# Altium schematic sheet my-cnc.SchDoc
size B
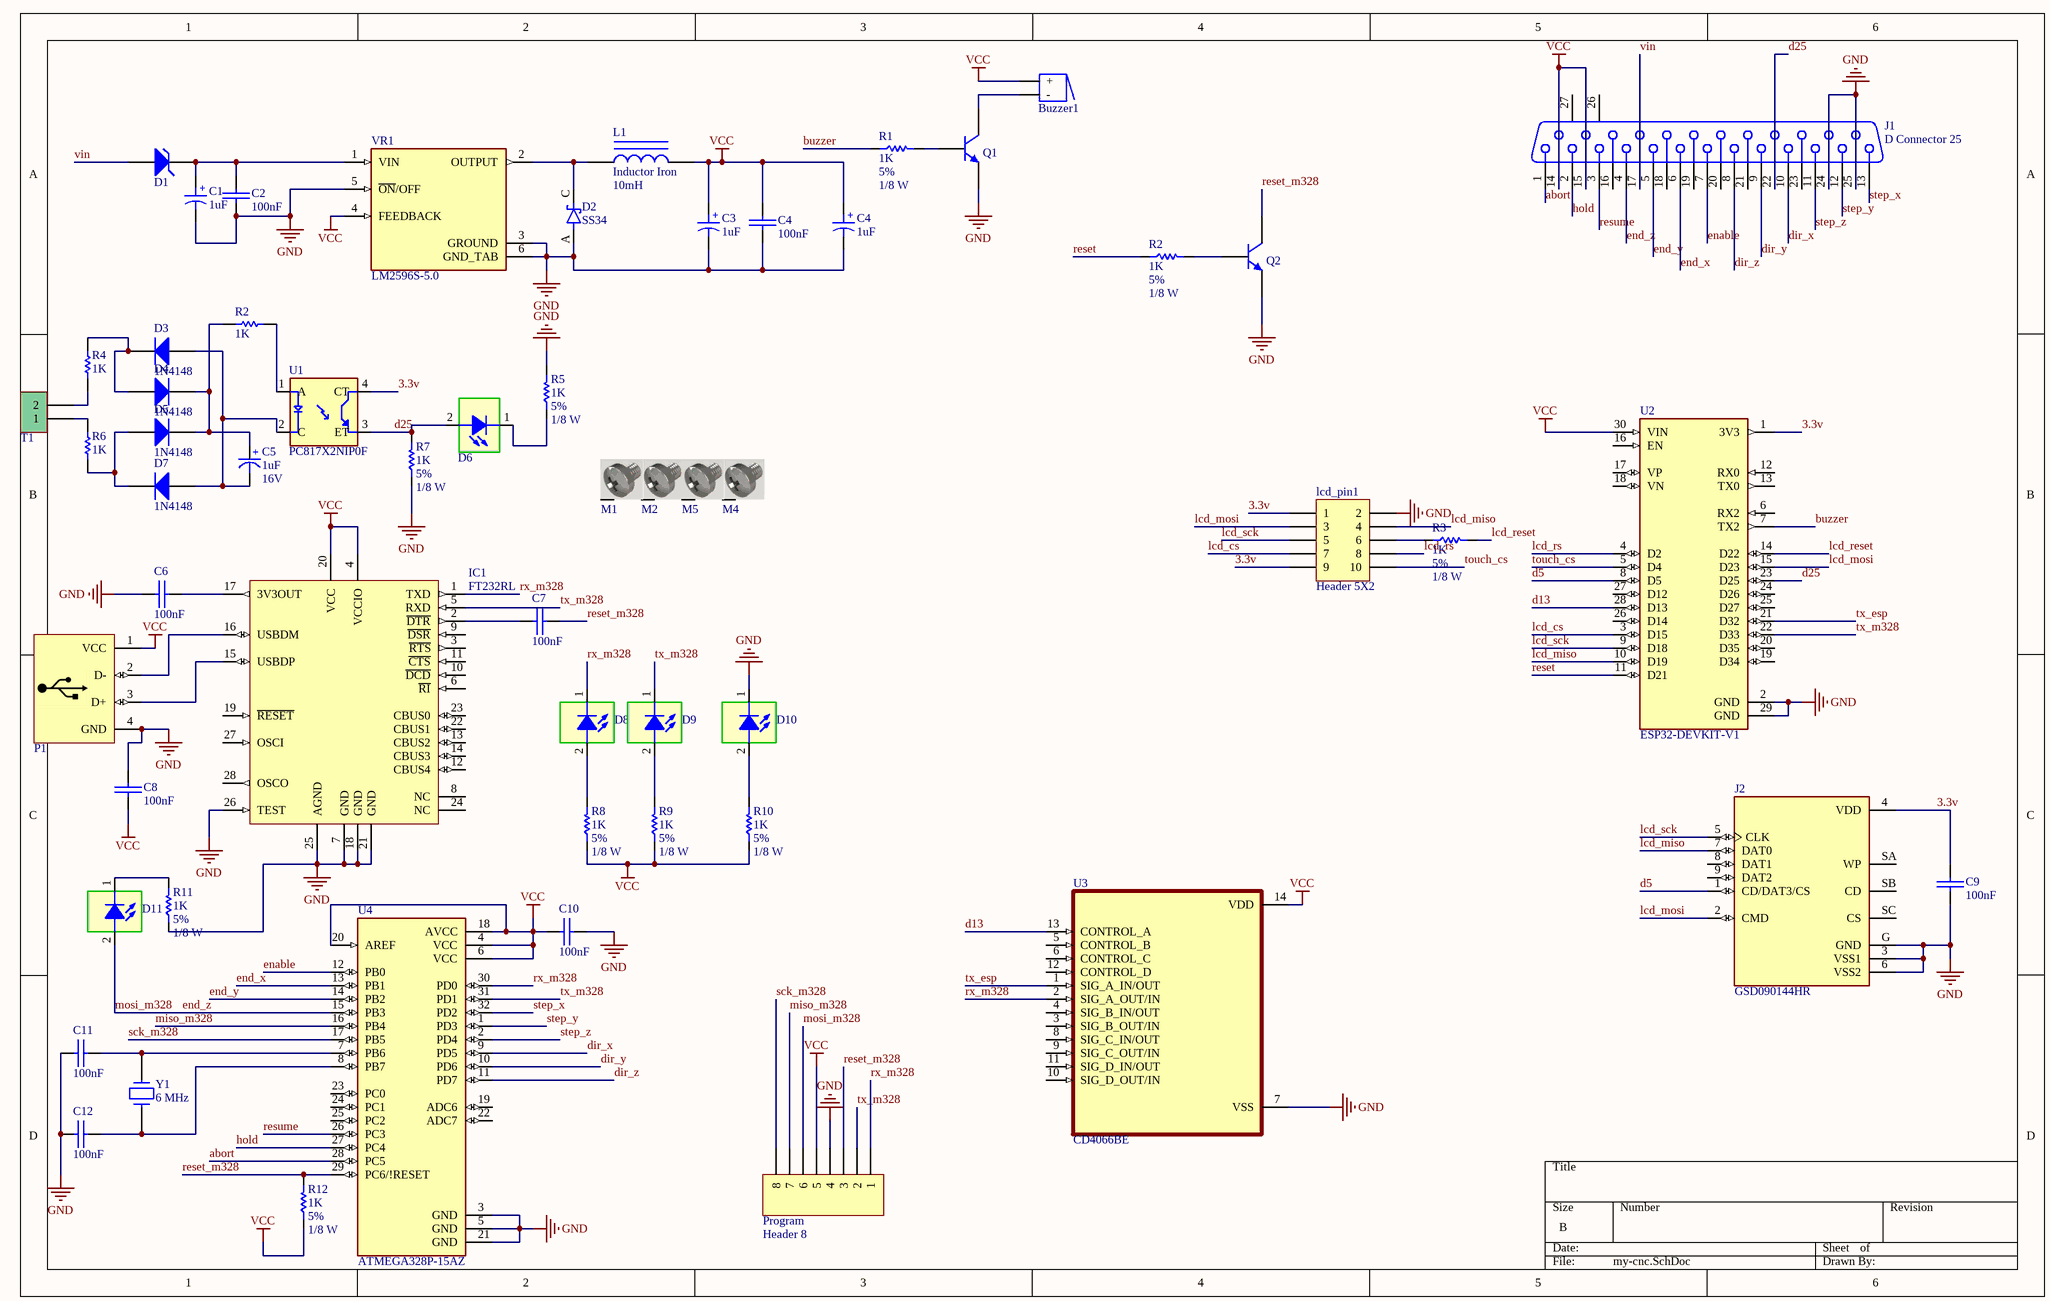
[diagram p0: my-cnc.SchDoc]

## Parts
(Parts that share a designator on the sheet are numbered #1, #2 ... from top to bottom, then left to right.)
Buzzer1  Buzzer  [BUZZER]  (value not drawn)
C1  1uF  [CAP SMD 470uF]
C2  100nF  [SMD_CAP_1206]
C3  1uF  [CAP SMD 470uF]
C4#1  1uF  [CAP SMD 470uF]
C4#2  100nF  [SMD_CAP_1206]
C5  Voltage: 16V  [cap 03]  (hidden comment: 1uF)
C6  100nF  [SMD_CAP_1206]
C7  100nF  [SMD_CAP_1206]
C8  100nF  [SMD_CAP_1206]
C9  100nF  [SMD_CAP_1206]
C10  100nF  [SMD_CAP_1206]
C11  100nF  [SMD_CAP_1206]
C12  100nF  [SMD_CAP_1206]
D1  Diode Zener  [Diode 1W]  (value not drawn)
D2  SS34  [DIOM7959X265N]
D3  1N4148  [DO-35]
D4  1N4148  [DO-35]
D5  1N4148  [DO-35]
D6  SMD 1206 LED  [LED 1206]  (value not drawn)
D7  1N4148  [DO-35]
D8  SMD 1206 LED  [LED 1206]  (value not drawn)
D9  SMD 1206 LED  [LED 1206]  (value not drawn)
D10  SMD 1206 LED  [LED 1206]  (value not drawn)
D11  SMD 1206 LED  [LED 1206]  (value not drawn)
IC1  FT232RL  [SSOP-28_L]
J1  D Connector 25  [DSUB1.385-2H25A]
J2  GSD090144HR  [AMPHENOL_GSD090144HR]
L1  Inductor Iron  value 10mH  [AXIAL-0.9]
lcd_pin1  Header 5X2  [HDR2X5]
M1  Screw  [Board Screw]  (value not drawn)
M2  Screw  [Board Screw]  (value not drawn)
M4  Screw  [Board Screw]  (value not drawn)
M5  Screw  [Board Screw]  (value not drawn)
P1  USB Connector  [USB2.5-2H4F]  (value not drawn)
Program  Header 8  [HDR1X8]
Q1  BC547  [TO-92 BENT]  (value not drawn)
Q2  BC547  [TO-92 BENT]  (value not drawn)
R1  Tolerance: 5%  Power: 1/8 W  [RES 1206 (3216X08L)]  (hidden comment: 1K)
R2#1  Tolerance: 5%  Power: 1/8 W  [RES 1206 (3216X08L)]  (hidden comment: 1K)
R2#2  1K  [Axial 0_25w_2_54mm]
R3  Tolerance: 5%  Power: 1/8 W  [RES 1206 (3216X08L)]  (hidden comment: 1K)
R4  1K  [Axial 0_25w_2_54mm]
R5  Tolerance: 5%  Power: 1/8 W  [RES 1206 (3216X08L)]  (hidden comment: 1K)
R6  1K  [Axial 0_25w_2_54mm]
R7  Tolerance: 5%  Power: 1/8 W  [RES 1206 (3216X08L)]  (hidden comment: 1K)
R8  Tolerance: 5%  Power: 1/8 W  [RES 1206 (3216X08L)]  (hidden comment: 1K)
R9  Tolerance: 5%  Power: 1/8 W  [RES 1206 (3216X08L)]  (hidden comment: 1K)
R10  Tolerance: 5%  Power: 1/8 W  [RES 1206 (3216X08L)]  (hidden comment: 1K)
R11  Tolerance: 5%  Power: 1/8 W  [RES 1206 (3216X08L)]  (hidden comment: 1K)
R12  Tolerance: 5%  Power: 1/8 W  [RES 1206 (3216X08L)]  (hidden comment: 1K)
T1  Phoenix terminal  [phoenix terminal 2]  (value not drawn)
U1  PC817X2NIP0F  [SOT254P975X400-4N]
U2  ESP32-DEVKIT-V1  [MODULE_ESP32_DEVKIT_V1]
U3  CD4066BE  [DIP794W45P254L1969H508Q14]
U4  ATMEGA328P-15AZ  [QFP80P900X900X120-32N]
VR1  LM2596S-5.0  [TO170P1524X483-6N]
Y1  6 MHz  [My_Crystal]

## Nets
GND: C1.2 C2.1(+) C3.2 C4#1.2 C4#2.1(+) C6.2(-) C8.1(+) C9.1(+) C10.2(-) C11.1(+) C12.1(+) D2.A D10.1 IC1.7(GND) IC1.18(GND) IC1.21(GND) IC1.25(AGND) IC1.26(TEST) J1.24 J1.25 J2.3(VSS1) J2.6(VSS2) J2.G(GND) lcd_pin1.2 P1.4(GND) Program.4 Q1.3(E) Q2.3(E) R5.2 R7.1 R11.1 U2.2(GND) U2.29(GND) U3.7(VSS) U4.3(GND) U4.5(GND) U4.21(GND) VR1.3(GROUND) VR1.5(~{ON}/OFF) VR1.6(GND_TAB)
VCC: Buzzer1.1(+) C3.1 C4#1.1 C4#2.2(-) C8.2(-) C10.1(+) IC1.4(VCCIO) IC1.20(VCC) J1.14 J1.15 L1.2 P1.1(VCC) Program.5 R8.1 R9.1 R10.1 R12.1 U2.30(VIN) U3.14(VDD) U4.4(VCC) U4.6(VCC) U4.18(AVCC) U4.20(AREF) VR1.4(FEEDBACK)
3.3v: C9.2(-) J2.4(VDD) lcd_pin1.1 lcd_pin1.9 U1.4(CT) U2.1(3V3)
abort: J1.1 U4.28(PC5)
buzzer: R1.1 U2.7(TX2)
d5: J2.1(CD/DAT3/CS) U2.8(D5)
d13: U2.28(D13) U3.13(CONTROL_A)
d25: D6.2 J1.22 R7.2 U1.3(ET) U2.23(D25)
dir_x: J1.10 U4.9(PD5)
dir_y: J1.9 U4.10(PD6)
dir_z: J1.8 U4.11(PD7)
enable: J1.7 U4.12(PB0)
end_x: J1.6 U4.13(PB1)
end_y: J1.5 U4.14(PB2)
end_z: D11.2 J1.4 Program.6 U4.15(PB3)  [also labelled mosi_m328]
hold: J1.2 U4.27(PC4)
lcd_cs: lcd_pin1.7 U2.3(D15)
lcd_miso: J2.7(DAT0) lcd_pin1.4 U2.10(D19)
lcd_mosi: J2.2(CMD) lcd_pin1.3 U2.15(D23)
lcd_reset: R3.2 U2.14(D22)
lcd_rs: lcd_pin1.8 U2.4(D2)
lcd_sck: J2.5(CLK) lcd_pin1.5 U2.9(D18)
miso_m328: Program.7 U4.16(PB4)
reset: R2#1.1 U2.11(D21)
reset_m328: C7.1(+) Program.3 Q2.1(C) R12.2 U4.29(PC6/!RESET)
resume: J1.3 U4.26(PC3)
rx_m328: D8.1 IC1.1(TXD) Program.1 U3.2(SIG_A_OUT/IN) U4.30(PD0)
sck_m328: Program.8 U4.17(PB5)
step_x: J1.13 U4.32(PD2)
step_y: J1.12 U4.1(PD3)
step_z: J1.11 U4.2(PD4)
touch_cs: lcd_pin1.10 U2.5(D4)
tx_esp: U2.21(D32) U3.1(SIG_A_IN/OUT)
tx_m328: D9.1 IC1.5(RXD) Program.2 U2.22(D33) U4.31(PD1)
vin: D1.1(A) J1.17
NetBuzzer1_2: Buzzer1.2(-) Q1.1(C)
NetC1_1: C1.1 C2.2(-) D1.2(K) VR1.1(VIN)
NetC5_1: C5.1(+) D4.2(K) D5.2(K) R2#2.1
NetC5_2: C5.2(-) D3.1(A) D7.1(A) U1.2(C)
NetC6_1: C6.1(+) IC1.17(3V3OUT)
NetC7_2: C7.2(-) IC1.2(~{DTR})
NetC11_2: C11.2(-) U4.7(PB6) Y1.2
NetC12_2: C12.2(-) U4.8(PB7) Y1.1
NetD2_C: D2.C(K) L1.1 VR1.2(OUTPUT)
NetD3_2: D3.2(K) D4.1(A) R4.2
NetD5_1: D5.1(A) D7.2(K) R6.1
NetD6_1: D6.1 R5.1
NetD8_2: D8.2 R8.2
NetD9_2: D9.2 R9.2
NetD10_2: D10.2 R10.2
NetD11_1: D11.1 R11.2
NetIC1_15: IC1.15(USBDP) P1.3(D+)
NetIC1_16: IC1.16(USBDM) P1.2(D-)
Netlcd_pin1_6: lcd_pin1.6 R3.1
NetQ1_2: Q1.2(B) R1.2
NetQ2_2: Q2.2(B) R2#1.2
NetR2#2_2: R2#2.2 U1.1(A)
NetR4_1: R4.1 T1.2
NetR6_2: R6.2 T1.1

Not connected (* = marked no-connect by the designer): IC1 3(~{RTS}) 6(~{RI}) 8(NC) 9(~{DSR}) 10(~{DCD}) 11(~{CTS}) 12(CBUS4) 13(CBUS2) 14(CBUS3) 19(~{RESET}) 22(CBUS1) 23(CBUS0) 24(NC) 27(OSCI) 28(OSCO); J1 16 18 19 20 21 23 26(MH1) 27(MH2); J2 8(DAT1) 9(DAT2) SA(WP) SB(CD) SC(CS); M1 S; M2 S; M4 S; M5 S; U2 6(RX2) 12(RX0) 13(TX0) 16(EN) 17(VP) 18(VN) 19(D34) 20(D35) 24(D26) 25(D27) 26(D14) 27(D12); U3 3(SIG_B_OUT/IN) 4(SIG_B_IN/OUT) 5(CONTROL_B) 6(CONTROL_C) 8(SIG_C_IN/OUT) 9(SIG_C_OUT/IN) 10(SIG_D_OUT/IN) 11(SIG_D_IN/OUT) 12(CONTROL_D); U4 19(ADC6) 22(ADC7) 23(PC0) 24(PC1) 25(PC2)

## Notes on the sheet
- (in symbol Cap ELECTROLITIC TOTAL SIZE) +

## Library data of the parts
Buzzer1 = Buzzer: Designer: Seyed Mohsen Ghasemain; ComponentLinkURL: www.picpars.com
C1 C3 C4#1 = Cap ELECTROLITIC TOTAL SIZE: Cap electrolitic radial; Designer: Abbas Basereh; Data: 16-12-2016; Part. No: *; VALUE: 1uF
C2 C4#2 C6-C12 = Cap-Bipolar: Bipolar Capacitor; Voltage: 100V; Designer: Saeid Jorablo; Organazation: ControTec; Adding Date: 1387/12/20; Value: 100nF
C5 = Cap-Polar: Polar Capacitor; Designer: Saeid Jorablo; Organazation: ControTec; Adding Date: 1387/12/20; Value: 1uF
D1 = Diode Zener: Zener Diode; Designer: Saeid Jorablo; Company: E.P.I.L; Voltage: 3.3 V; Design Date: 2011/11/02
D2 = SS34: Diode Schottky 40 V 3A Surface Mount SMC (DO-214AB); MF: ON Semiconductor; Package: SMC-2 ON Semiconductor; MP: SS34; Value: *; Availability: In Stock; SnapEDA_Link: https://www.snapeda.com/parts/SS34/Onsemi/view-part/?ref=snap; Price: None; Check_prices: https://www.snapeda.com/parts/SS34/Onsemi/view-part/?ref=eda
D3-D5 D7 = Diode 1N4148: High Conductance Fast Diode; Published: 8-Jun-2000; LatestRevisionDate: 17-Jul-2002; LatestRevisionNote: Re-released for DXP Platform.; DatasheetVersion: 1997; PackageReference: DO-35; Publisher: Altium Limited; PackageDescription: Diode, Axial; Body 3.8 x 1.9 mm (LxDia. max), Lead Dia. 0.53 mm (max); Code_JEDEC: DO-204-AH; ComponentLink1Description: Manufacturer Link; ComponentLink1URL: http://www.fairchildsemi.com/; ComponentLink2Description: Datasheet; ComponentLink2URL: http://www.fairchildsemi.com/ds/1N%2F1N4148.pdf
D6 D8-D11 = LED SMD 1206
IC1 = FT232RL: USB UART Asynchronous Serial Data Transfer Chip, SSOP-28, Tape and Reel; Published: 19-Aug-2010; DatasheetVersion: ver 2.07, Jul-2010; PackageVersion: 2010; PackageReference: SSOP-28; Publisher: Altium Limited; PackageDescription: 28-Pin Small Outline Package 0.65 mm Pitch; ComponentLink1Description: Manufacturer Link; ComponentLink1URL: http://www.ftdichip.com/Products/ICs/FT232R.htm; ComponentLink2Description: Datasheet; ComponentLink2URL: http://www.ftdichip.com/Support/Documents/DataSheets/ICs/DS_FT232R.pdf
J1 = D Connector 25: Receptacle Assembly, 25 Position, Right Angle; PackageDocument: U; Positions: 25; Published: 15-Jun-2001; LatestRevisionDate: 17-Jul-2002; LatestRevisionNote: Re-released for DXP Platform.; DatasheetDocument: 19-Mar-1999; PackageReference: 787202; Publisher: Altium Limited; Orientation: Right Angle; Gender: Receptacle
J2 = GSD090144HR: Sd Card Connector, Push-push Type, 9 Position.; MF: Amphenol ICC (Commercial Products); Price: None; Availability: In Stock; MP: GSD090144HR; Package: None; SnapEDA_Link: https://www.snapeda.com/parts/GSD090144HR/Amphenol/view-part/?ref=snap; Check_prices: https://www.snapeda.com/parts/GSD090144HR/Amphenol/view-part/?ref=eda; Value: *; Purchase-URL: https://pricing.snapeda.com/search/part/GSD090144HR/?ref=eda
L1 = Inductor Iron: Magnetic-Core Inductor; Published: 24-Mar-1999; LatestRevisionDate: 17-Jul-2002; LatestRevisionNote: Re-released for DXP Platform.; PackageReference: AXIAL-0.9; Publisher: Altium Limited; PackageDescription: Axial Device, Thru-Hole; 2 Leads; 0.9 in Pin Spacing
lcd_pin1 = Header 5X2: Header, 5-Pin, Dual row; LatestRevisionDate: 17-Jul-2002; LatestRevisionNote: Re-released for DXP Platform.; Publisher: Altium Limited
M1 M2 M4 M5 = Board Screw: Board Screw With Spacer
P1 = USB B-Type: USB Connector-B Type; Adding Date: 10/26/2010
Program = Header 8: Header, 8-Pin; LatestRevisionDate: 17-Jul-2002; LatestRevisionNote: Re-released for DXP Platform.; Publisher: Altium Limited
Q1 Q2 = BC547: NPN General-purpose Transistor; Designer: Abbas Basereh; Desc.: Plastic Medium-Power. Silicon NPN Transistors; Data: 27-12-2016
R1 R2#1 R3 R5 R7-R12 = Resistor: Value: 1K
R2#2 R4 R6 = RES Axial 0.25W: Designer: Abbas Basereh; Desc.: RES Axial 0.25W; Data: 4-1-2017
T1 = Phoenix terminal 2: Terminal 2 Pin; Designer: Seyed Mohsen Ghasemain; E-mail: picpars@gmail.com; ComponentLinkURL: www.picpars.com
U1 = PC817X2NIP0F: Optoisolator Transistor Output 5000Vrms 1 Channel 4-SMD; MF: Sharp Microelectronics; Availability: Unavailable; MP: PC817X2NIP0F; Package: SMD-4 Sharp; SnapEDA_Link: https://www.snapeda.com/parts/PC817X2NIP0F/Sharp%20Microelectronics/view-part/2874099/?ref=snap; Value: *; Price: None
U2 = ESP32-DEVKIT-V1: Dual core, Wi-Fi: 2.4 GHz up to 150 Mbits/s,BLE (Bluetooth Low Energy) and legacy Bluetooth, 32 bits, Up to 240 MHz; MF: Do it; Price: None; Availability: Not in stock; Package: None; MP: ESP32-DEVKIT-V1; Value: *; SnapEDA_Link: https://www.snapeda.com/parts/ESP32-DEVKIT-V1/Do+it/view-part/?ref=snap; Check_prices: https://www.snapeda.com/parts/ESP32-DEVKIT-V1/Do+it/view-part/?ref=eda
U3 = CD4066BE: 10-pA on-state leakage current, 20-V, 1:1 (SPST), 4-channel analog switch; MF: Texas Instruments; Value: *; SnapEDA_Link: https://www.snapeda.com/parts/CD4066BE/Texas+Instruments/view-part/?ref=snap; MP: CD4066BE; Purchase-URL: https://pricing.snapeda.com/search/part/CD4066BE/?ref=eda; Check_prices: https://www.snapeda.com/parts/CD4066BE/Texas+Instruments/view-part/?ref=eda; Availability: In Stock; Price: None; Package: PDIP-14 Texas Instruments
U4 = ATMEGA328P-15AZ: AVR Automotive, AEC-Q100, AVRÂ® ATmega Microcontroller IC 8-Bit 16MHz 32KB _16K x 16_ FLASH 32-TQFP _7x7_; MF: Microchip; SnapEDA_Link: https://www.snapeda.com/parts/ATMEGA328P-15AZ/Microchip/view-part/1227234/?ref=snap; Value: *; Digi-Key_Part_Number: ATMEGA328P-15AZCT-ND; Digi-Key_Purchase_URL: https://www.digikey.com/product-detail/en/microchip-technology/ATMEGA328P-15AZ/ATMEGA328P-15AZCT-ND/2477177?utm_source=snapeda&utm_medium=aggregator&utm_campaign=symbol; MP: ATMEGA328P-15AZ; Package: TQFP-32 Microchip
Y1 = CRYSTAL
VR1 = LM2596S-5.0: Value: *; MP: LM2596S-5.0; Package: None; Availability: Unavailable; Price: None